# EAGLE design X_Driver (EAGLE 6.1)
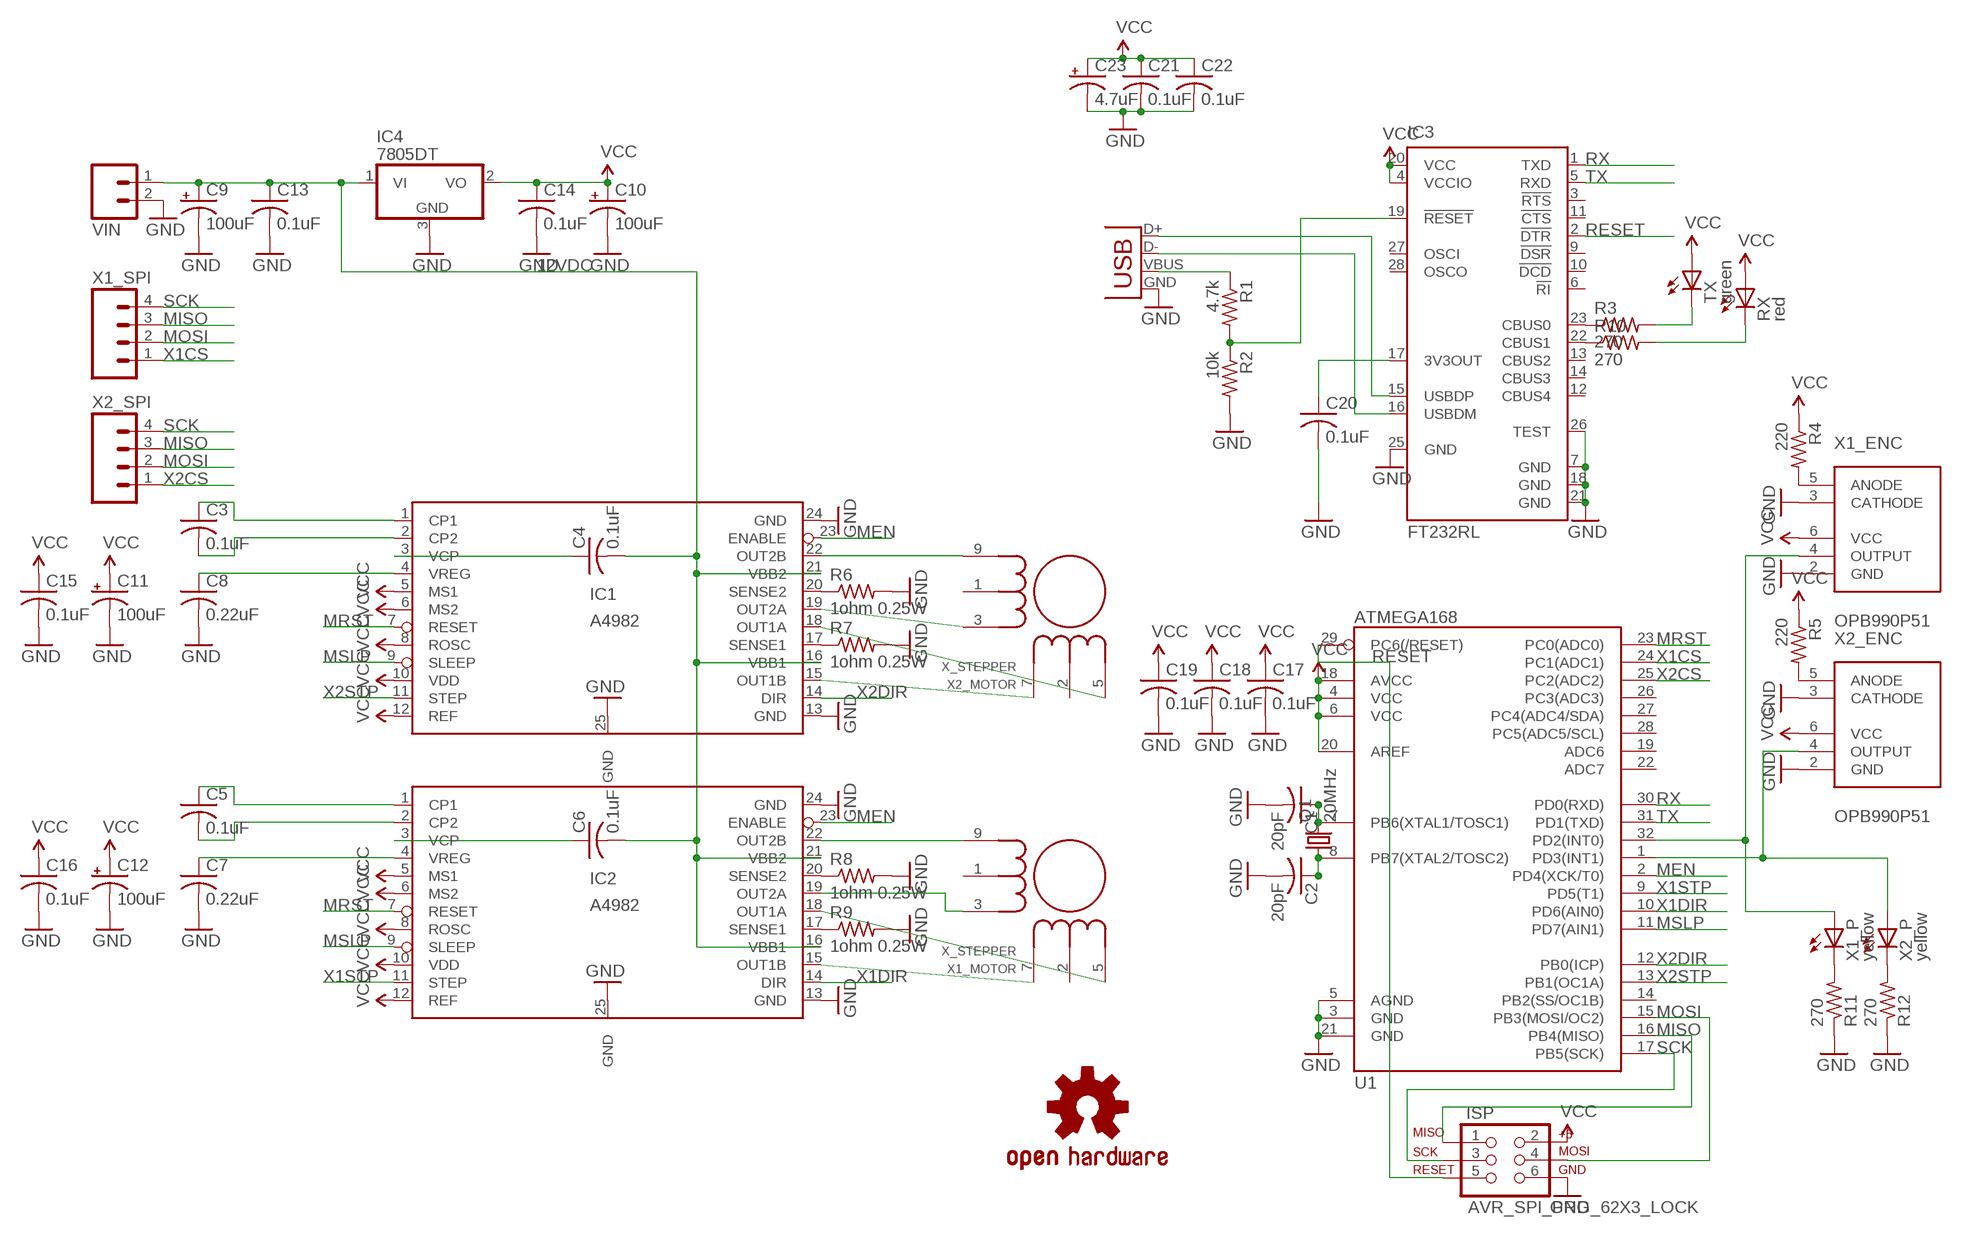
[diagram p0: schematic, sheet 1]

## Parts
C1  20pF  C-USC0603  [C0603]
C2  20pF  C-USC0603  [C0603]
C3  0.1uF  C-USC0603  [C0603]
C4  0.1uF  C-USC0603  [C0603]
C5  0.1uF  C-USC0603  [C0603]
C6  0.1uF  C-USC0603  [C0603]
C7  0.22uF  C-USC0603  [C0603]
C8  0.22uF  C-USC0603  [C0603]
C9  100uF  CPOL-US153CLV-0505  [153CLV-0505]
C10  100uF  CPOL-US153CLV-0505  [153CLV-0505]
C11  100uF  CPOL-US153CLV-0505  [153CLV-0505]
C12  100uF  CPOL-US153CLV-0505  [153CLV-0505]
C13  0.1uF  C-USC0603  [C0603]
C14  0.1uF  C-USC0603  [C0603]
C15  0.1uF  C-USC0603  [C0603]
C16  0.1uF  C-USC0603  [C0603]
C17  0.1uF  C-USC0603  [C0603]
C18  0.1uF  C-USC0603  [C0603]
C19  0.1uF  C-USC0603  [C0603]
C20  0.1uF  C-USC0603  [C0603]
C21  0.1uF  C-USC0603  [C0603]
C22  0.1uF  C-USC0603  [C0603]
C23  4.7uF  CPOL-US153CLV-0505  [153CLV-0505]
IC1  A4982  [24TSSOP]
IC2  A4982  [24TSSOP]
IC3  FT232RL  [SSOP28]
IC4  7805DT  [TO252]
ISP  AVR_SPI_PRG_62X3_LOCK  [2X3_LOCK]
Q1  20MHz  CRYSTALHC49UP  [HC49UP]
R1  4.7k  R-US_R0603  [R0603]
R2  10k  R-US_R0603  [R0603]
R3  270  R-US_R0603  [R0603]
R4  220  R-US_R0603  [R0603]
R5  220  R-US_R0603  [R0603]
R6  1ohm 0.25W  R-US_R0603  [R0603]
R7  1ohm 0.25W  R-US_R0603  [R0603]
R8  1ohm 0.25W  R-US_R0603  [R0603]
R9  1ohm 0.25W  R-US_R0603  [R0603]
R10  270  R-US_R0603  [R0603]
R11  270  R-US_R0603  [R0603]
R12  270  R-US_R0603  [R0603]
RX  red  LEDCHIP-LED0603  [CHIP-LED0603]
TX  green  LEDCHIP-LED0603  [CHIP-LED0603]
U1  ATMEGA168  [TQFP32-08]
U$1  OSHW-LOGOM  [OSHW-LOGO-M]
VIN  M025MM  [SCREWTERMINAL-5MM-2]
X1  USBSMD  [USB-MINIB]
X1_ENC  OPB990P51  [OPB990P51]
X1_MOTOR  X_STEPPER  [2X5_SHROUDED]
X1_P  yellow  LEDCHIP-LED0603  [CHIP-LED0603]
X1_SPI  M04LOCK  [1X04_LOCK]
X2_ENC  OPB990P51  [OPB990P51]
X2_MOTOR  X_STEPPER  [2X5_SHROUDED]
X2_P  yellow  LEDCHIP-LED0603  [CHIP-LED0603]
X2_SPI  M04LOCK  [1X04_LOCK]

## Nets
12VDC: C4.2 C6.2 C9.+ C13.1 IC1.16(VBB1) IC1.21(VBB2) IC2.16(VBB1) IC2.21(VBB2) IC4.1(VI) VIN.1
GND: C1.2 C2.2 C7.2 C8.2 C9.- C10.- C11.- C12.- C13.2 C14.2 C15.2 C16.2 C17.2 C18.2 C19.2 C20.2 C21.2 C22.2 C23.- IC1.13(GND) IC1.24(GND) IC1.25(GND) IC2.13(GND) IC2.24(GND) IC2.25(GND) IC3.7(GND) IC3.18(GND) IC3.21(GND) IC3.25(GND) IC3.26(TEST) IC4.3(GND) ISP.6 R2.2 R6.2 R7.2 R8.2 R9.2 R11.1 R12.1 U1.3(GND) U1.5(AGND) U1.21(GND) VIN.2 X1.GND X1_ENC.2(GND) X1_ENC.3(CATHODE) X2_ENC.2(GND) X2_ENC.3(CATHODE)
MEN: IC1.23(ENABLE) IC2.23(ENABLE) U1.2(PD4(XCK/T0))
MISO: ISP.1 U1.16(PB4(MISO)) X1_SPI.3 X2_SPI.3
MOSI: ISP.4 U1.15(PB3(MOSI/OC2)) X1_SPI.2 X2_SPI.2
MRST: IC1.7(RESET) IC2.7(RESET) U1.23(PC0(ADC0))
MSLP: IC1.9(SLEEP) IC2.9(SLEEP) U1.11(PD7(AIN1))
N$1: C1.1 Q1.2 U1.7(PB6(XTAL1/TOSC1))
N$2: C2.1 Q1.1 U1.8(PB7(XTAL2/TOSC2))
N$3: C20.1 IC3.17(3V3OUT)
N$4: IC3.19(!RESET) R1.2 R2.1
N$5: R1.1 X1.VBUS
N$6: R4.2 X1_ENC.5(ANODE)
N$7: R5.2 X2_ENC.5(ANODE)
N$8: IC1.18(OUT1A) X2_MOTOR.5(A1)
N$9: U1.1(PD3(INT1)) X2_ENC.4(OUTPUT) X2_P.A
N$10: U1.32(PD2(INT0)) X1_ENC.4(OUTPUT) X1_P.A
N$11: IC3.16(USBDM) X1.D-
N$12: C5.1 IC2.1(CP1)
N$13: C5.2 IC2.2(CP2)
N$14: C3.1 IC1.1(CP1)
N$15: C3.2 IC1.2(CP2)
N$16: C4.1 IC1.3(VCP)
N$17: IC1.15(OUT1B) X2_MOTOR.7(A2)
N$18: C6.1 IC2.3(VCP)
N$19: IC1.19(OUT2A) X2_MOTOR.3(B1)
N$20: C8.1 IC1.4(VREG)
N$21: C7.1 IC2.4(VREG)
N$22: IC1.22(OUT2B) X2_MOTOR.9(B2)
N$23: IC2.18(OUT1A) X1_MOTOR.5(A1)
N$24: IC2.15(OUT1B) X1_MOTOR.7(A2)
N$25: IC2.22(OUT2B) X1_MOTOR.9(B2)
N$26: IC2.19(OUT2A) X1_MOTOR.3(B1)
N$27: IC3.15(USBDP) X1.D+
N$28: IC3.23(CBUS0) R3.1
N$29: IC1.20(SENSE2) R6.1
N$30: IC1.17(SENSE1) R7.1
N$31: IC2.20(SENSE2) R8.1
N$32: IC2.17(SENSE1) R9.1
N$33: IC3.22(CBUS1) R10.1
N$34: R3.2 TX.C
N$35: R10.2 RX.C
N$36: R11.2 X1_P.C
N$37: R12.2 X2_P.C
RESET: IC3.2(!DTR) ISP.5 U1.29(PC6(/RESET))
RX: IC3.1(TXD) U1.30(PD0(RXD))
SCK: ISP.3 U1.17(PB5(SCK)) X1_SPI.4 X2_SPI.4
TX: IC3.5(RXD) U1.31(PD1(TXD))
VCC: C10.+ C11.+ C12.+ C14.1 C15.1 C16.1 C17.1 C18.1 C19.1 C21.1 C22.1 C23.+ IC1.5(MS1) IC1.6(MS2) IC1.8(ROSC) IC1.10(VDD) IC1.12(REF) IC2.5(MS1) IC2.6(MS2) IC2.8(ROSC) IC2.10(VDD) IC2.12(REF) IC3.4(VCCIO) IC3.20(VCC) IC4.2(VO) ISP.2 R4.1 R5.1 RX.A TX.A U1.4(VCC) U1.6(VCC) U1.18(AVCC) U1.20(AREF) X1_ENC.6(VCC) X2_ENC.6(VCC)
X1CS: U1.24(PC1(ADC1)) X1_SPI.1
X1DIR: IC2.14(DIR) U1.10(PD6(AIN0))
X1STP: IC2.11(STEP) U1.9(PD5(T1))
X2CS: U1.25(PC2(ADC2)) X2_SPI.1
X2DIR: IC1.14(DIR) U1.12(PB0(ICP))
X2STP: IC1.11(STEP) U1.13(PB1(OC1A))
Unconnected: IC3.3(!RTS) IC3.6(!RI) IC3.9(!DSR) IC3.10(!DCD) IC3.11(!CTS) IC3.12(CBUS4) IC3.13(CBUS2) IC3.14(CBUS3) IC3.27(OSCI) IC3.28(OSCO) U1.14(PB2(SS/OC1B)) U1.19(ADC6) U1.22(ADC7) U1.26(PC3(ADC3)) U1.27(PC4(ADC4/SDA)) U1.28(PC5(ADC5/SCL)) X1_MOTOR.1(CB) X1_MOTOR.2(CA) X2_MOTOR.1(CB) X2_MOTOR.2(CA)

## Library data of the parts
C1-C8 C13-C22 = rcl:C-US: CAPACITOR, American symbol
C9-C12 C23 = rcl:CPOL-US: POLARIZED CAPACITOR, American symbol
IC1 IC2 = i3_Pick_Place:A4982: Allegro A4982 microstepping driver
IC3 = ftdichip:FT232R: Source: http://www.ftdichip.com/Documents/DataSheets/DS_FT232R_v104.pdf; MPN: FT232RL; OC_FARNELL: 1146032; OC_NEWARK: 91K9918
IC4 = linear:78*: Positive VOLTAGE REGULATOR Source: http://cache.national.com/ds/LM/LM78L05.pdf http://www.fairchildsemi.com/ds/LM/LM7805.pdf
ISP = SparkFun:AVR_SPI_PRG_6: AVR ISP 6 Pin This is the reduced ISP connector for AVR programming. Common on Arduino. This footprint will take up less PCB space and can be used with a 10-pin to 6-pin adapter such as SKU: BOB-08508
Q1 = crystal:CRYSTAL: CRYSTAL; OC_FARNELL: unknown; OC_NEWARK: unknown
R1-R12 = rcl:R-US_: RESISTOR, American symbol
RX TX X1_P X2_P = adafruit:LED: LED OSRAM: - CHIPLED LG R971, LG N971, LY N971, LG Q971, LY Q971, LO R971, LY R971 LH N974, LH R974 LS Q976, LO Q976, LY Q976 LO Q996 - Hyper CHIPLED LW Q18S LB Q993, LB Q99A, LB R99A - SideLED LS A670, LO A670, LY A670, LG A670, LP A670 LB A673, LV A673, LT A673, LW A673 LH A674 LY A675 LS A676, LA A676, LO A676, LY A676, LW A676 LS A679, LY A679, LG A679 - Hyper Micro SIDELED® LS Y876, LA Y876, LO Y876, LY Y876 LT Y87S - SmartLED LW L88C, LW L88S LB L89C, LB L89S, LG L890 LS L89K, LO L89K, LY L89K LS L896, LA L896, LO L896, LY L896 - TOPLED LS T670, LO T670, LY T670, LG T670, LP T670 LSG T670, LSP T670, LSY T670, LOP T670, LYG T670 LG T671, LOG T671, LSG T671 LB T673, LV T673, LT T673, LW T673 LH T674 LS T676, LA T676, LO T676, LY T676, LB T676, LH T676, LSB T676, LW T676 LB T67C, LV T67C, LT T67C, LS T67K, LO T67K, LY T67K, LW E67C LS E67B, LA E67B, LO E67B, LY E67B, LB E67C, LV E67C, LT E67C LW T67C LS T679, LY T679, LG T679 LS T770, LO T770, LY T770, LG T770, LP T770 LB T773, LV T773, LT T773, LW T773 LH T774 LS E675, LA E675, LY E675, LS T675 LS T776, LA T776, LO T776, LY T776, LB T776 LHGB T686 LT T68C, LB T68C - Hyper Mini TOPLED® LB M676 - Mini TOPLED Santana® LG M470 LS M47K, LO M47K, LY M47K Source: http://www.osram.convergy.de/
U1 = SparkFun:ATMEGA168
U$1 = SparkFun:OSHW-LOGO: Open Source Hardware Logo This logo indicates the piece of hardware it is found on incorporates a OSHW license and/or adheres to the definition of open source hardware found here: http://freedomdefined.org/OSHW
VIN = SparkFun:M02: Header 2 Standard 2-pin 0.1" header. Use with straight break away headers (SKU : PRT-00116), right angle break away headers (PRT-00553), swiss pins (PRT-00743), machine pins (PRT-00117), and female headers (PRT-00115). Molex polarized connector foot print use with SKU : PRT-08233 with associated crimp pins and housings.
X1 = SparkFun:USB: USB Connectors USB-B-PTH is fully proven SKU : PRT-00139 USB-miniB is fully proven SKU : PRT-00587 USB-A-PCB is untested. USB-A-H is throughly reviewed, but untested. Spark Fun Electronics SKU : PRT-00437 USB-B-SMT is throughly reviewed, but untested. Needs silkscreen touching up. USB-A-S has not been used/tested USB-MB-H has not been used/tested
X1_ENC X2_ENC = i3_Pick_Place:OPB990P51: Optek OPB990P51 flying-lead IR opto-interrupter
X1_MOTOR X2_MOTOR = i3_Pick_Place:X_STEPPER: Pinout for X stepper motors
X1_SPI X2_SPI = SparkFun:M04: Header 4 Standard 4-pin 0.1" header. Use with straight break away headers (SKU : PRT-00116), right angle break away headers (PRT-00553), swiss pins (PRT-00743), machine pins (PRT-00117), and female headers (PRT-00115). Molex polarized connector foot print use with SKU : PRT-08231 with associated crimp pins and housings. 1MM SMD Version SKU: PRT-10208

## Board
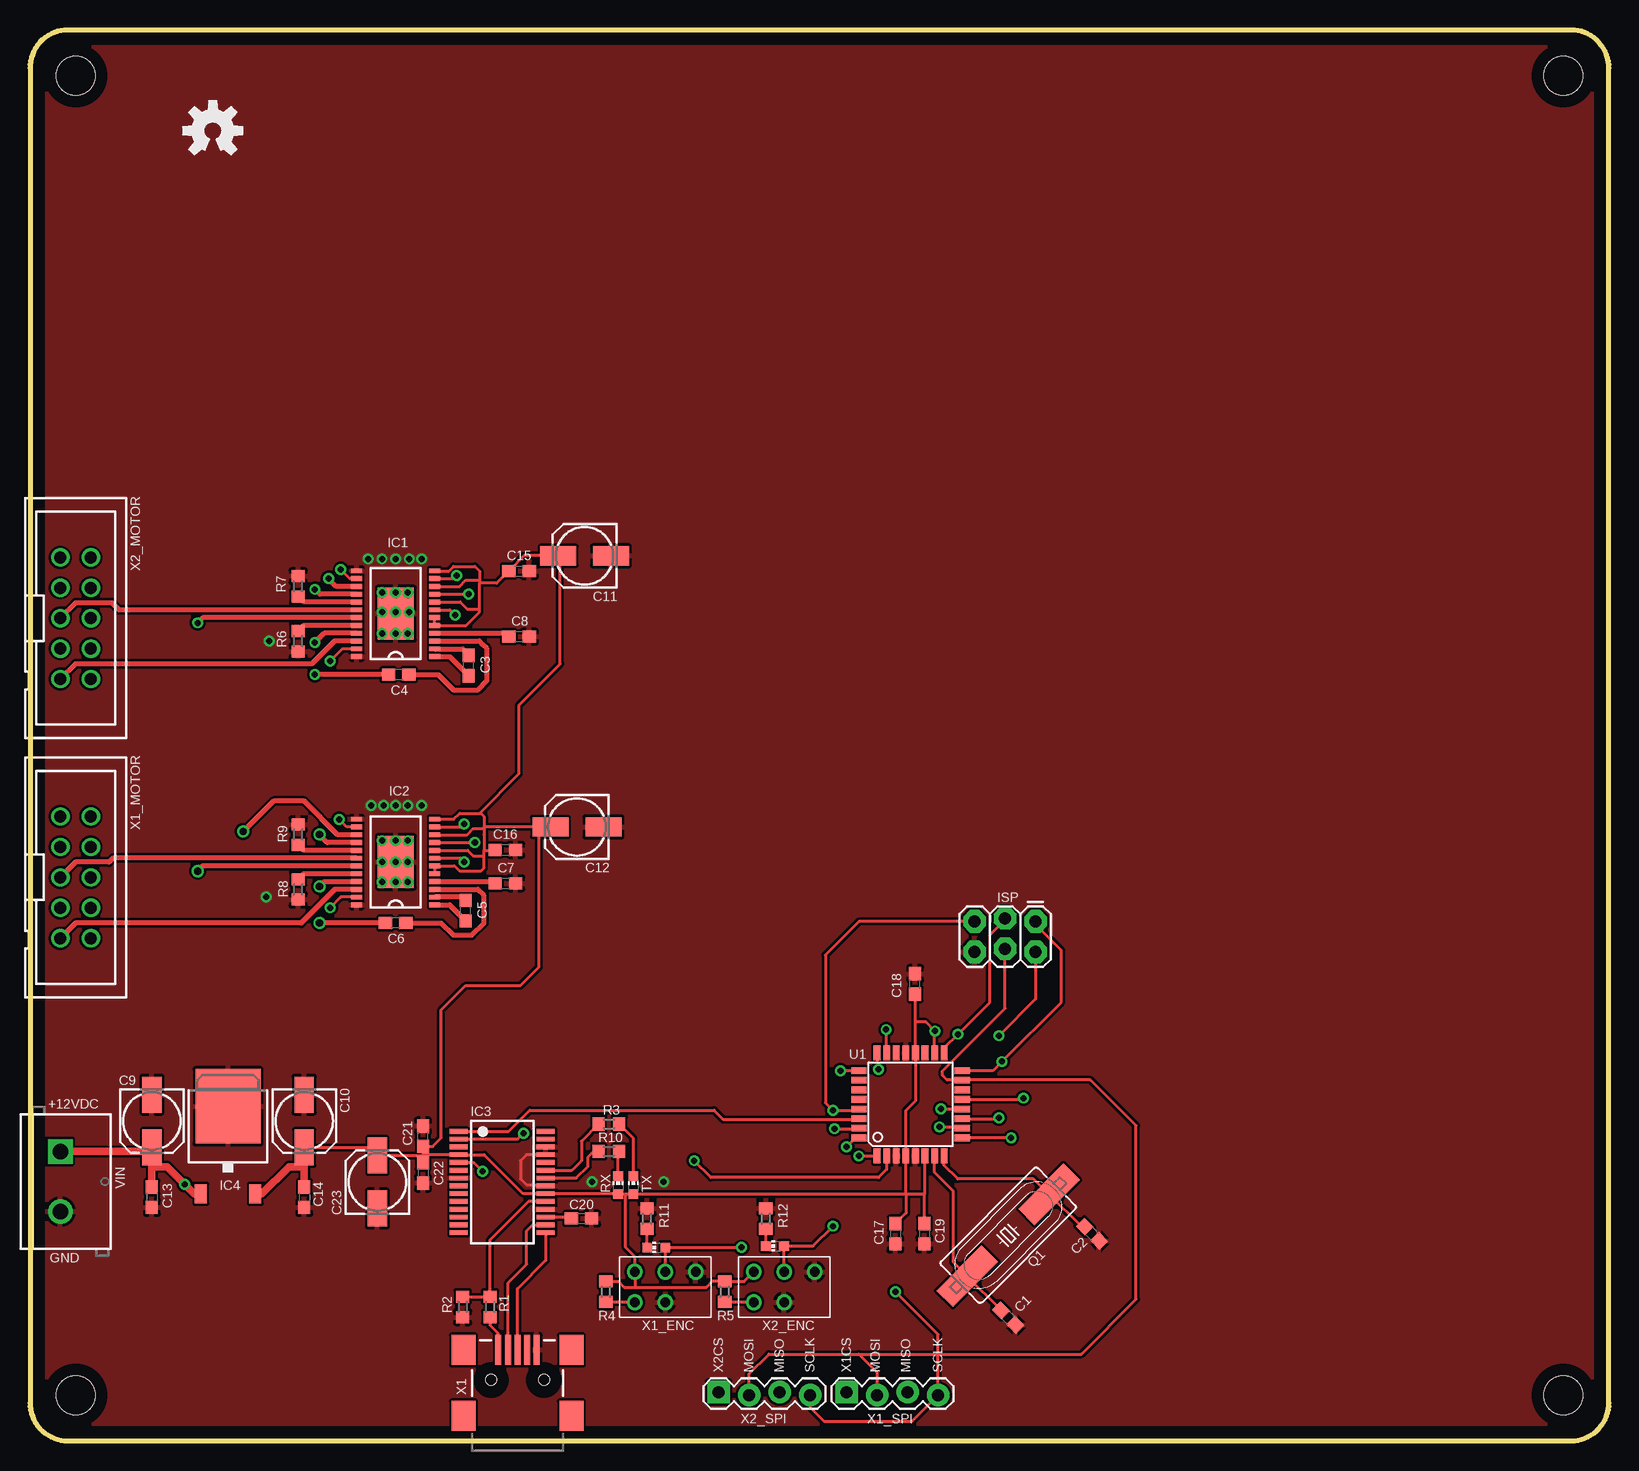
[diagram p1: board, top side]
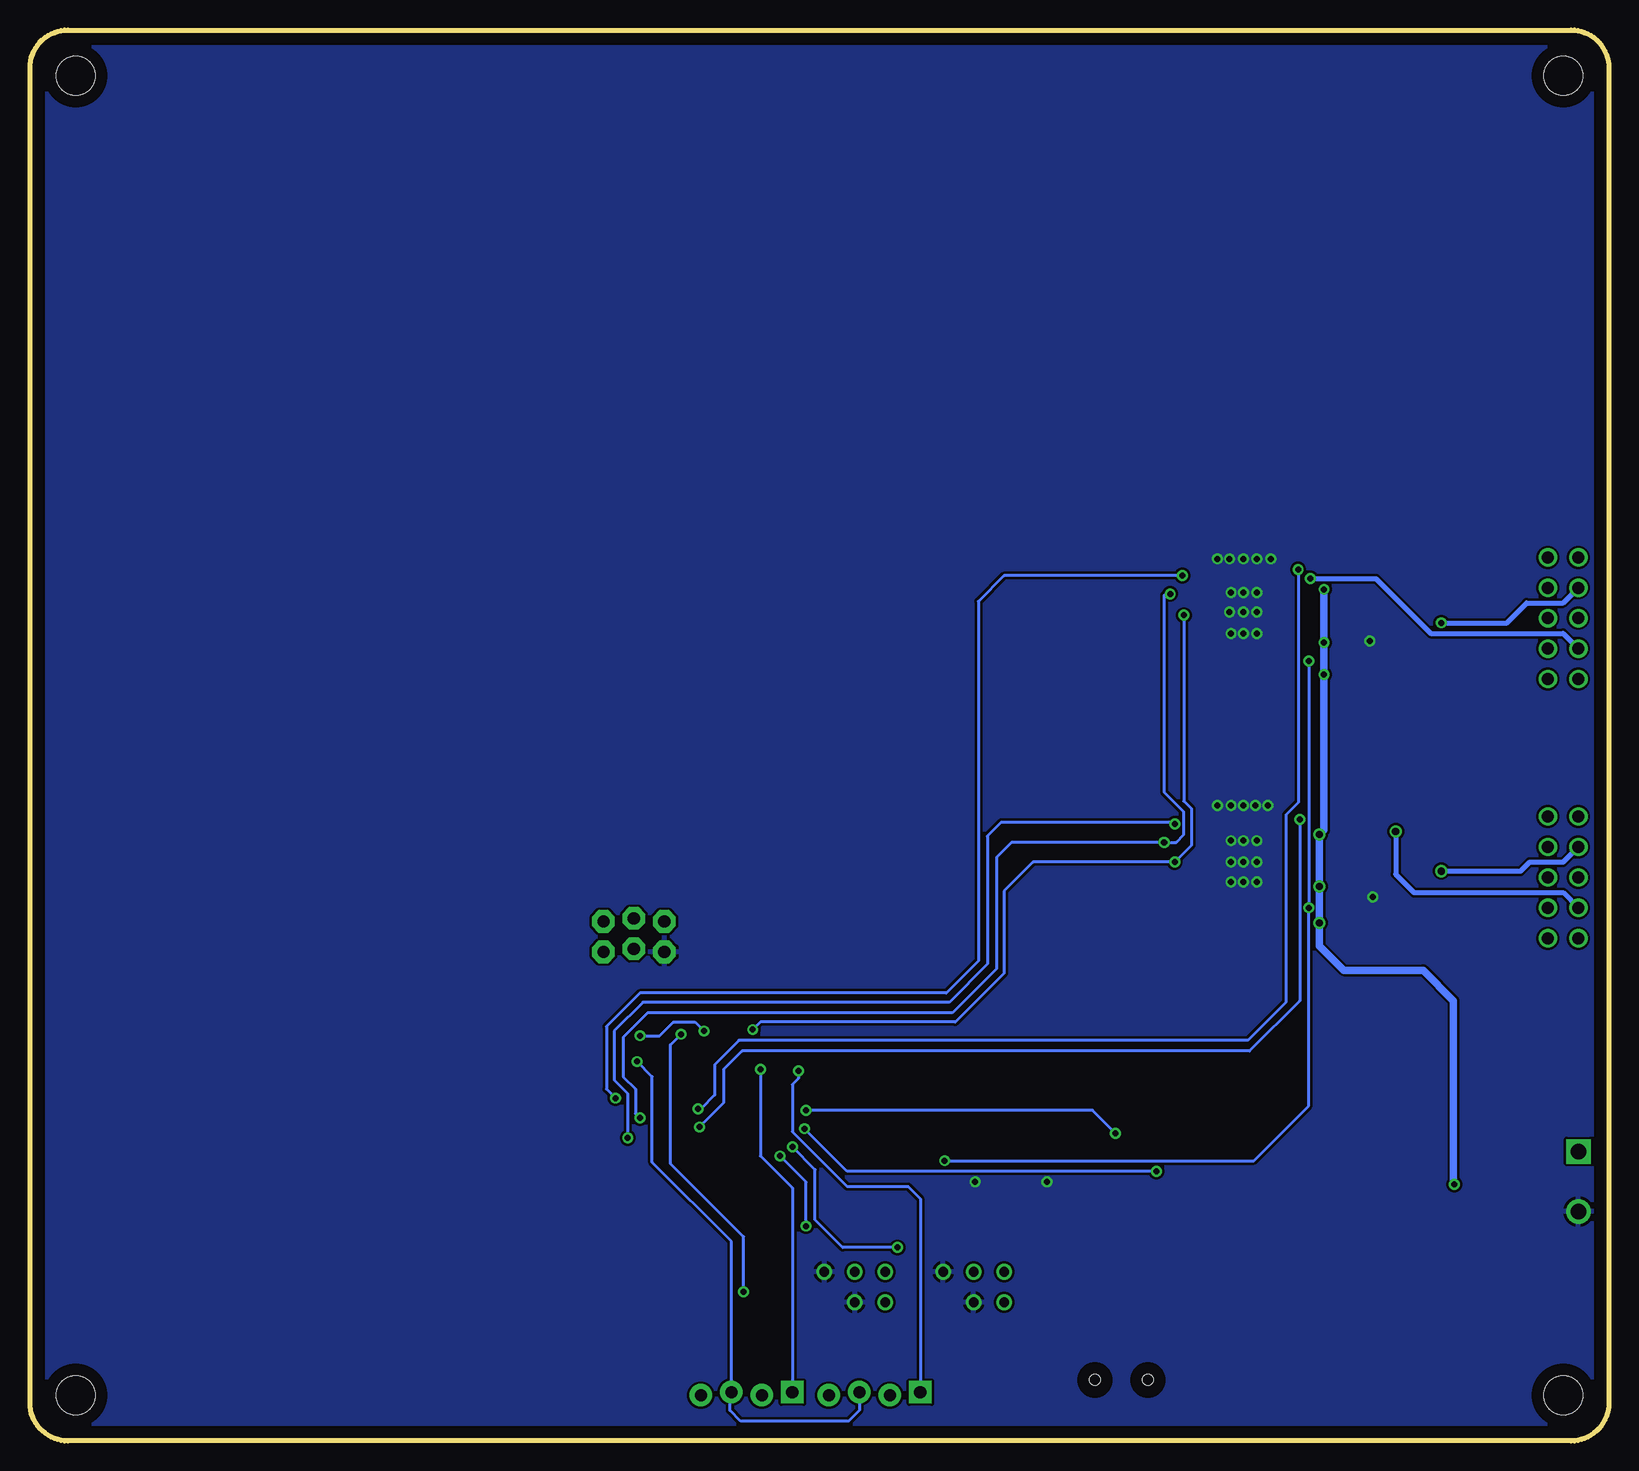
[diagram p2: board, bottom side, seen from below]

Size 131.62 x 117.62 mm. Coordinates in mm from the lower left corner, seen from the top.
Outline: 0,114.44 0,3.17 arc90 3.17,0 128.44,0 arc90 131.62,3.17 131.62,114.44 arc90 128.44,117.62 3.17,117.62 arc90 0,114.44
Copper layers (1*16): Top 0.035mm / dielectric 1.5mm / Bottom 0.035mm
Design rules: minimum track width 10mil, minimum drill 24mil, track to track 8mil, track to pad 8mil, pad to pad 8mil, via to via 8mil, smd to smd 8mil, copper to edge 40mil, drill to drill 8mil, minimum pad ring 10mil, minimum via ring 8mil, stop-mask expansion 4mil, vias tented up to drill 0mil, thermal gap 10mil
Holes 3.2 mm at 3.81,3.81 127.81,3.81 3.81,113.81 127.81,113.81

### Footprints (pad centres in the part's own frame; a part is rotated, then mirrored left to right if it is on the bottom)
C0603 = smd 1.1 x 1: 1 -0.85,0; 2 0.85,0
153CLV-0505 = smd 3 x 1.6: + 2.2,0; - -2.2,0
24TSSOP = smd 0.9 x 0.4: 1 -3.25,3.575; 2 -3.25,2.925; 3 -3.25,2.275; 4 -3.25,1.625; 5 -3.25,0.975; 6 -3.25,0.325; 7 -3.25,-0.325; 8 -3.25,-0.975; 9 -3.25,-1.625; 10 -3.25,-2.275; 11 -3.25,-2.925; 12 -3.25,-3.575; 13 3.25,-3.575; 14 3.25,-2.925; 15 3.25,-2.275; 16 3.25,-1.625; 17 3.25,-0.975; 18 3.25,-0.325; 19 3.25,0.325; 20 3.25,0.975; 21 3.25,1.625; 22 3.25,2.275; 23 3.25,2.925; 24 3.25,3.575 | smd 3 x 4.32: 25 0,0
SSOP28 = smd 0.4 x 1.5: 1 -4.225,-3.625; 2 -3.575,-3.625; 3 -2.925,-3.625; 4 -2.275,-3.625; 5 -1.625,-3.625; 6 -0.975,-3.625; 7 -0.325,-3.625; 8 0.325,-3.625; 9 0.975,-3.625; 10 1.625,-3.625; 11 2.275,-3.625; 12 2.925,-3.625; 13 3.575,-3.625; 14 4.225,-3.625; 15 4.225,3.625; 16 3.575,3.625; 17 2.925,3.625; 18 2.275,3.625; 19 1.625,3.625; 20 0.975,3.625; 21 0.325,3.625; 22 -0.325,3.625; 23 -0.975,3.625; 24 -1.625,3.625; 25 -2.275,3.625; 26 -2.925,3.625; 27 -3.575,3.625; 28 -4.225,3.625
TO252 = smd 1 x 1.6: 1 -2.28,-4.8; 2 2.28,-4.8 | smd 5.4 x 6.2: 3 0,2.5
2X3_LOCK = drill 1.016 pad 1.88 octagon: 1 0,0; 2 0,2.54; 3 2.54,-0.254; 4 2.54,2.286; 5 5.08,0; 6 5.08,2.54
HC49UP = smd 5.334 x 1.93: 1 -4.826,0; 2 4.826,0
R0603 = smd 1 x 1.1: 1 -0.85,0; 2 0.85,0
CHIP-LED0603 = smd 0.8 x 0.8: A 0,-0.75; C 0,0.75
TQFP32-08 = smd 1.27 x 0.559: 1 -4.293,2.8; 2 -4.293,2; 3 -4.293,1.2; 4 -4.293,0.4; 5 -4.293,-0.4; 6 -4.293,-1.2; 7 -4.293,-2; 8 -4.293,-2.8; 17 4.293,-2.8; 18 4.293,-2; 19 4.293,-1.2; 20 4.293,-0.4; 21 4.293,0.4; 22 4.293,1.2; 23 4.293,2; 24 4.293,2.8 | smd 0.559 x 1.27: 9 -2.8,-4.293; 10 -2,-4.293; 11 -1.2,-4.293; 12 -0.4,-4.293; 13 0.4,-4.293; 14 1.2,-4.293; 15 2,-4.293; 16 2.8,-4.293; 25 2.8,4.293; 26 2,4.293; 27 1.2,4.293; 28 0.4,4.293; 29 -0.4,4.293; 30 -1.2,4.293; 31 -2,4.293; 32 -2.8,4.293
SCREWTERMINAL-5MM-2 = drill 1.3 pad 2.032 square: 1 0,0 | drill 1.3 pad 2.032: 2 5,0
USB-MINIB = smd 2.5 x 0.5: D+ 2.5,0; D- 2.5,0.8; GND 2.5,-1.6; ID 2.5,-0.8; VBUS 2.5,1.6 | smd 2.5 x 2: MTN1 -3,4.5; MTN2 2.5,4.5; MTN3 -3,-4.5; MTN4 2.5,-4.5 | hole 0.9: 0,2.2; 0,-2.2
OPB990P51 = drill 0.8: 2 -2.54,-1.27; 3 0,1.27; 4 0,-1.27; 5 2.54,1.27; 6 2.54,-1.27
2X5_SHROUDED = drill 1 pad 1.422: 1 -5.08,-1.27; 2 -5.08,1.27; 3 -2.54,-1.27; 4 -2.54,1.27; 5 0,-1.27; 6 0,1.27; 7 2.54,-1.27; 8 2.54,1.27; 9 5.08,-1.27; 10 5.08,1.27
1X04_LOCK = drill 1.016 pad 1.88 square: 1 0,0.127 | drill 1.016 pad 1.88: 2 2.54,-0.127; 3 5.08,0.127; 4 7.62,-0.127

### Placement (x,y rotation side)
C1  81.53,10.29 315 top
C2  88.52,17.27 315 top
C3  36.58,64.64 90 top
C4  30.73,63.88 180 top
C5  36.32,44.2 90 top
C6  30.48,43.18 180 top
C7  39.62,46.48 0 top
C8  40.77,67.06 0 top
C9  10.16,26.67 270 top
C10  22.86,26.67 270 top
C11  46.23,73.79 180 top
C12  45.59,51.18 180 top
C13  10.16,20.32 270 top
C14  22.86,20.32 270 top
C15  40.77,72.52 0 top
C16  39.62,49.28 0 top
C17  72.14,17.27 270 top
C18  73.79,38.1 90 top
C19  74.55,17.27 270 top
C20  45.97,18.54 0 top
C21  32.77,25.4 90 top
C22  32.77,22.35 270 top
C23  28.96,21.59 90 top
IC1  30.48,68.96 180 top
IC2  30.48,48.26 180 top
IC3  39.37,21.59 270 top
IC4  16.51,25.4 0 top
ISP  83.82,43.31 180 top
Q1  81.53,17.14 225 top
R1  38.35,11.18 90 top
R2  36.07,11.18 270 top
R3  48.26,26.42 0 top
R4  48.01,12.45 270 top
R5  57.91,12.45 270 top
R6  22.35,66.67 270 top
R7  22.35,71.25 90 top
R8  22.35,45.97 270 top
R9  22.35,50.55 90 top
R10  48.26,24.13 0 top
R11  51.44,18.54 270 top
R12  61.34,18.54 270 top
RX  49.02,21.34 0 top
TX  50.29,21.34 0 top
U1  73.41,28.07 90 top
U$1  15.24,109.22 0 top
VIN  2.54,24.13 270 top
X1  40.64,5.08 90 top
X1_ENC  52.96,12.83 180 top
X1_MOTOR  3.81,46.99 270 top
X1_P  52.2,16.13 90 top
X1_SPI  68.07,3.94 0 top
X2_ENC  62.87,12.83 180 top
X2_MOTOR  3.81,68.58 270 top
X2_P  62.1,16.26 90 top
X2_SPI  57.4,3.94 0 top

### Tracks (layer width: path | path; a pad name or v marks a point on that pad's centre or on a via)
12VDC  (via drill 0.5, 0.6)
  Top 0.406: IC2.16 24.79,49.88 v24.13,50.55 | v24.13,46.23 24.54,46.63 IC2.21 | C6.2 v24.13,43.18 | IC1.16 24.16,70.59 v23.75,70.99 | v23.75,66.55 24.54,67.34 IC1.21 | C4.2 v23.75,63.88
  Top 0.61: VIN.1 10.16,24.13 | 10.16,24.13 C9.+ | 10.16,24.13 10.16,22.86 | 10.16,22.86 C13.1 | IC4.1 13.69,20.6 v12.89,21.4 11.43,22.86 10.16,22.86
  Bottom 0.61: v12.89,21.4 12.95,21.46 12.95,36.7 15.49,39.24 22.1,39.24 24.13,41.27 v24.13,43.18 v24.13,46.23 v24.13,50.55 23.75,50.93 v23.75,63.88 v23.75,66.55 v23.75,70.99
GND  (via drill 0.5)
  Top 0.254: IC3.25 41.39,23.86 40.89,23.37 40.89,21.84 41.4,21.34 42.92,21.34 IC3.21
  other vias: 19.94,66.67 29.34,70.74 30.48,70.74 31.5,70.74 31.62,69.09 30.48,69.09 29.34,69.09 29.34,67.31 30.48,67.31 31.5,67.31 29.34,50.04 30.48,50.04 31.5,50.04 31.5,48.26 30.48,48.26 29.34,48.26 29.34,46.61 30.48,46.61 31.5,46.61 30.48,52.96 31.5,52.96 32.64,52.96 29.46,52.96 28.45,52.96 30.48,73.53 31.62,73.53 32.64,73.53 29.34,73.53 28.19,73.53 19.68,45.34 46.86,21.59 52.83,21.59
  pour Bottom: 0,0 132.08,0 132.08,118.11 0,118.11
  pour Top: 0,0 132.08,0 132.08,118.11 0,118.11
MEN  (via drill 0.5)
  Top 0.254: IC2.23 25.9,45.34 v25.02,44.45 | IC1.23 26.03,66.04 v25.02,65.02 | U1.2 71.41,22.64 70.74,21.97 56.77,21.97 v55.37,23.37
  Bottom 0.254: v25.02,65.02 v25.02,44.45 25.02,27.94 29.59,23.37 v55.37,23.37
MISO  (via drill 0.5)
  Top 0.254: U1.16 80.27,30.87 v81.03,31.62 85.98,36.58 85.98,40.89 83.82,43.05 ISP.1
  Bottom 0.254: X2_SPI.3 62.48,2.54 63.37,1.65 72.39,1.65 73.28,2.54 73.28,3.94 X1_SPI.3 73.15,16.64 79.76,23.24 79.76,30.35 v81.03,31.62
MOSI
  Top 0.254: X2_SPI.2 59.94,5.59 61.59,7.24 69.09,7.24 | 69.09,7.24 70.61,5.71 X1_SPI.2 | 69.09,7.24 87.63,7.24 92.2,11.81 92.2,26.29 88.39,30.1 77.73,30.1 | 77.73,30.1 U1.15 | 77.73,30.1 76.45,30.1 76.07,30.48 76.07,30.86 81.28,36.07 ISP.4
MRST  (via drill 0.5)
  Top 0.254: IC2.7 35.87,48.59 v36.2,48.26 | IC1.7 34.98,69.29 v35.43,68.83 | v71.37,34.29 71.37,32.39 U1.23
  Bottom 0.254: v35.43,68.83 35.43,53.34 34.8,52.7 34.8,49.66 v36.2,48.26 48.01,48.26 50.42,45.85 50.42,38.99 54.48,34.92 70.74,34.92 v71.37,34.29
MSLP  (via drill 0.5)
  Top 0.254: IC1.9 33.76,70.61 v36.58,70.61 | IC2.9 v37.06,49.88 v37.08,49.91 | U1.11 80.72,26.87 v80.77,26.92
  Bottom 0.254: v36.58,70.61 36.96,70.61 37.08,70.48 37.08,54.1 35.43,52.45 35.43,50.55 36.07,49.91 v37.08,49.91 | v37.06,49.88 49.81,49.88 51.05,48.64 51.05,39.37 54.74,35.69 80.14,35.69 82.17,33.66 82.17,30.35 81.15,29.34 81.15,27.3 v80.77,26.92
N$1
  Top 0.254: C1.1 80.93,10.92 Q1.2 76.96,14.89 76.96,20.83 75.41,22.38 U1.7
N$2
  Top 0.254: C2.1 87.63,17.87 Q1.1 83.66,21.84 77.34,21.84 76.21,22.98 U1.8
N$3
  Top 0.254: IC3.17 45,18.66 C20.1
N$4
  Top 0.254: R2.1 R1.2 38.35,16.76 41.55,19.96 IC3.19
N$5
  Top 0.254: X1.VBUS 39.04,8.97 38.35,9.65 R1.1
N$6
  Top 0.254: R4.2 50.38,11.6 X1_ENC.5
N$7
  Top 0.254: R5.2 60.29,11.6 X2_ENC.5
N$8
  Top 0.406: IC1.18 7.42,69.29 6.86,69.85 3.81,69.85 X2_MOTOR.5
N$9  (via drill 0.5)
  Top 0.254: X2_ENC.4 62.87,16.24 X2_P.A 65.28,16.26 v66.93,17.91 | v69.09,23.75 70.58,23.75 U1.1
  Bottom 0.254: v66.93,17.91 66.93,21.59 v69.09,23.75
N$10  (via drill 0.5)
  Top 0.254: X1_ENC.4 52.96,16.12 X1_P.A v59.31,16.13 | v68.07,24.51 68.83,25.27 U1.32
  Bottom 0.254: v59.31,16.13 63.88,16.13 66.17,18.41 66.17,22.61 v68.07,24.51
N$11
  Top 0.254: X1.D- 39.84,13.17 41.4,14.73 41.4,17.53 41.91,18.03 42.98,18.03 IC3.16
N$12
  Top 0.406: IC2.1 34.98,44.69 C5.1
N$13
  Top 0.406: C5.2 36.03,45.34 IC2.2
N$14
  Top 0.406: IC1.1 34.98,65.39 C3.1
N$15
  Top 0.406: IC1.2 36.07,66.04 36.58,65.53 C3.2
N$16
  Top 0.406: C4.1 34.04,63.88 35.31,62.61 37.34,62.61 38.1,63.37 38.1,66.04 37.78,66.36 37.47,66.67 37.45,66.69 IC1.3
N$17  (via drill 0.5)
  Top 0.406: IC1.15 25.54,71.24 v24.89,71.88
  Bottom 0.406: v24.89,71.88 19.43,71.88 14.86,67.31 3.81,67.31 X2_MOTOR.7
N$18
  Top 0.406: C6.1 34.29,43.18 35.31,42.16 36.83,42.16 37.85,43.18 37.85,45.47 37.33,45.98 IC2.3
N$19  (via drill 0.5)
  Top 0.406: IC1.19 14.41,68.64 v13.97,68.2
  Bottom 0.406: v13.97,68.2 8.51,68.2 6.86,69.85 3.81,69.85 X2_MOTOR.3
N$20
  Top 0.406: IC1.4 39.64,67.34 C8.1
N$21
  Top 0.406: IC2.4 38.62,46.63 C7.1
N$22
  Top 0.406: IC1.22 25.41,66.69 23.5,64.77 3.81,64.77 X2_MOTOR.9
N$23
  Top 0.406: IC2.18 6.93,48.59 6.6,48.26 3.81,48.26 X1_MOTOR.5
N$24  (via drill 0.6)
  Top 0.406: IC2.15 25.66,50.53 22.86,53.34 20.32,53.34 v17.78,50.8
  Bottom 0.406: v17.78,50.8 17.78,47.24 16.26,45.72 3.81,45.72 X1_MOTOR.7
N$25
  Top 0.406: IC2.22 25.41,45.98 22.61,43.18 3.81,43.18 X1_MOTOR.9
N$26  (via drill 0.6)
  Top 0.406: IC2.19 14.41,47.94 v13.97,47.5
  Bottom 0.406: X1_MOTOR.3 3.81,48.26 6.6,48.26 7.37,47.5 v13.97,47.5
N$27
  Top 0.254: X1.D+ 40.64,12.7 42.99,15.05 IC3.15
N$28
  Top 0.254: IC3.23 45.17,22.57 45.97,23.37 45.97,24.98 R3.1
N$29
  Top 0.406: IC1.20 22.81,67.99 R6.1
N$30
  Top 0.406: IC1.17 22.81,69.94 R7.1
N$31
  Top 0.406: IC2.20 22.81,47.28 R8.1
N$32
  Top 0.406: IC2.17 22.81,49.23 R9.1
N$33
  Top 0.254: R10.1 46.99,24.13 46.48,23.62 46.48,22.86 45.54,21.91 IC3.22
N$34
  Top 0.254: TX.C 50.29,25.23 R3.2
N$35
  Top 0.254: RX.C 49.02,24.04 R10.2
N$36
  Top 0.254: X1_P.C 51.44,16.14 R11.2
N$37
  Top 0.254: X2_P.C R12.2
RESET  (via drill 0.5)
  Top 0.254: IC3.2 40.66,25.16 v41.15,25.65 | U1.29 69,27.56 v66.93,27.56 66.29,28.19 66.29,40.51 69.09,43.31 ISP.5
  Bottom 0.254: v41.15,25.65 43.05,27.56 v66.93,27.56
RX
  Top 0.254: IC3.1 39.91,25.82 41.66,27.56 57.02,27.56 57.78,26.8 69.04,26.8 U1.30
SCK  (via drill 0.5)
  Top 0.254: X2_SPI.4 65.02,2.79 66.17,1.65 73.53,1.65 X1_SPI.4 75.69,8.89 v72.14,12.45 | U1.17 76.21,32.77 v77.34,33.91 80.01,36.58 80.01,42.16 81.28,43.43 ISP.3
  Bottom 0.254: v72.14,12.45 72.14,17.02 78.23,23.11 78.23,33.02 v77.34,33.91
TX  (via drill 0.5)
  Top 0.254: IC3.5 36.98,23.21 v37.72,22.48 | v67.06,26.04 69.08,26.04 U1.31
  Bottom 0.254: v37.72,22.48 63.5,22.48 v67.06,26.04
VCC  (via drill 0.5)
  Top 0.254: C10.+ 28.28,24.47 C23.+ 32.68,23.79 32.77,23.88 | 32.77,23.88 C21.1 33.57,24.55 34.29,25.27 34.29,35.94 36.32,37.97 40.89,37.97 42.42,39.5 42.42,51.05 42.29,51.18 | 32.77,23.88 C22.1 | 32.77,23.88 35.73,23.88 IC3.4 37.86,23.86 41.11,20.61 IC3.20 43.02,20.59 RX.A 49.53,20.59 | 49.53,20.59 TX.A 73.01,20.59 73.03,20.57 | 37.85,49.23 38.73,49.23 | IC2.5 IC2.6 35.38,47.94 35.81,47.5 37.59,47.5 37.85,47.75 37.85,48.77 | 37.85,48.77 37.85,49.23 | IC2.12 35.33,51.84 35.81,52.32 37.47,52.32 | 37.47,52.32 37.59,52.32 37.85,52.07 37.85,51.18 | 37.85,51.18 37.85,51.05 | 37.85,51.05 37.85,50.55 | 37.85,50.55 37.85,49.23 | 37.84,50.53 37.85,50.55 | IC2.10 36.44,50.53 36.96,51.05 37.85,51.05 | IC2.8 36.49,49.23 36.96,48.77 37.85,48.77 | C12.+ 42.29,51.18 | 42.29,51.18 37.85,51.18 | IC1.8 35.85,69.94 36.45,69.34 37.47,69.34 | IC1.6 IC1.5 36.36,67.99 37.47,69.09 37.47,69.34 | 37.47,69.34 37.47,71.5 | IC1.10 35.8,71.24 36.32,71.75 37.47,71.75 | 37.47,71.5 38.9,71.5 C15.1 41.19,73.79 C11.+ 44.2,73.62 44.2,64.77 40.77,61.34 40.77,55.63 37.47,52.32 | 37.47,71.75 37.47,71.5 | IC1.12 34.94,72.54 35.31,72.9 37.08,72.9 37.47,72.52 37.47,71.75 | 73.81,34.92 U1.20 73.81,28.34 73.01,27.54 U1.4 73.03,23.77 73.03,20.57 | 73.81,34.92 73.81,37.23 C18.1 | U1.18 75.41,34.2 | 75.41,34.2 74.68,34.92 73.81,34.92 | U1.6 74.55,23.72 74.55,20.57 | C17.1 73.03,19.01 73.03,20.57 | v75.44,34.16 75.41,34.2 | ISP.2 83.82,36.83 v80.77,33.78 | R4.1 49.06,13.3 49.53,12.83 50.42,12.83 | 50.42,12.83 56.39,12.83 56.9,13.34 57.87,13.34 R5.1 59.52,13.3 X2_ENC.6 | 50.42,12.83 X1_ENC.6 50.42,15.37 49.66,16.13 49.66,20.46 49.53,20.59 | 74.55,20.57 73.03,20.57
  Top 0.254: C19.1 74.55,20.57
  Top 0.406: 38.73,49.23 C16.1
  Top 0.61: C10.+ 22.86,22.86 | 22.86,22.86 C14.1 | IC4.2 19.33,20.6 21.59,22.86 22.86,22.86
  Bottom 0.254: v80.77,33.78 79.12,33.78 77.98,34.92 76.2,34.92 v75.44,34.16
X1CS  (via drill 0.5)
  Top 0.254: U1.24 70.61,31.12 v70.74,30.99
  Bottom 0.254: v70.74,30.99 70.74,23.75 68.07,21.08 X1_SPI.1
X1DIR  (via drill 0.5)
  Top 0.254: IC2.14 26.41,51.19 v25.78,51.82 | v75.82,26.16 77.6,26.16 U1.10
  Bottom 0.254: v25.78,51.82 25.78,36.7 29.97,32.51 72.26,32.51 73.79,30.99 73.79,28.19 v75.82,26.16
X1STP  (via drill 0.5)
  Top 0.254: IC2.11 35.95,51.19 v36.2,51.44 | v81.79,25.27 80.37,25.27 U1.9
  Bottom 0.254: v36.2,51.44 36.32,51.56 50.67,51.56 51.82,50.42 51.82,39.75 54.99,36.58 80.52,36.58 82.93,34.16 82.93,30.1 81.79,28.96 v81.79,25.27
X2CS  (via drill 0.5)
  Top 0.254: U1.25 v67.57,30.87 v67.56,30.86
  Bottom 0.254: v67.56,30.86 67.56,30.23 68.07,29.72 68.07,25.78 63.5,21.21 58.42,21.21 57.4,20.19 X2_SPI.1
X2DIR  (via drill 0.5)
  Top 0.254: IC1.14 26.67,71.89 v25.91,72.64 | v75.95,27.69 77.6,27.69 77.68,27.69 | 77.68,27.69 77.72,27.69 77.72,27.56 | U1.12 77.68,27.69
  Bottom 0.254: v25.91,72.64 25.91,53.21 26.92,52.2 26.92,36.58 30.1,33.4 72.52,33.4 74.55,31.37 74.55,28.83 75.69,27.69 v75.95,27.69
X2STP  (via drill 0.5)
  Top 0.254: IC1.11 35.31,71.89 v35.56,72.14 | U1.13 82.7,28.47 v82.8,28.57
  Bottom 0.254: v35.56,72.14 50.42,72.14 52.58,69.98 52.58,40.01 55.24,37.34 80.77,37.34 83.57,34.54 83.57,29.34 v82.8,28.57

### Text on the board
_tsilk: +12VDC | GND | X2CS | MOSI | MISO | SCLK | X1CS | MOSI | MISO | SCLK